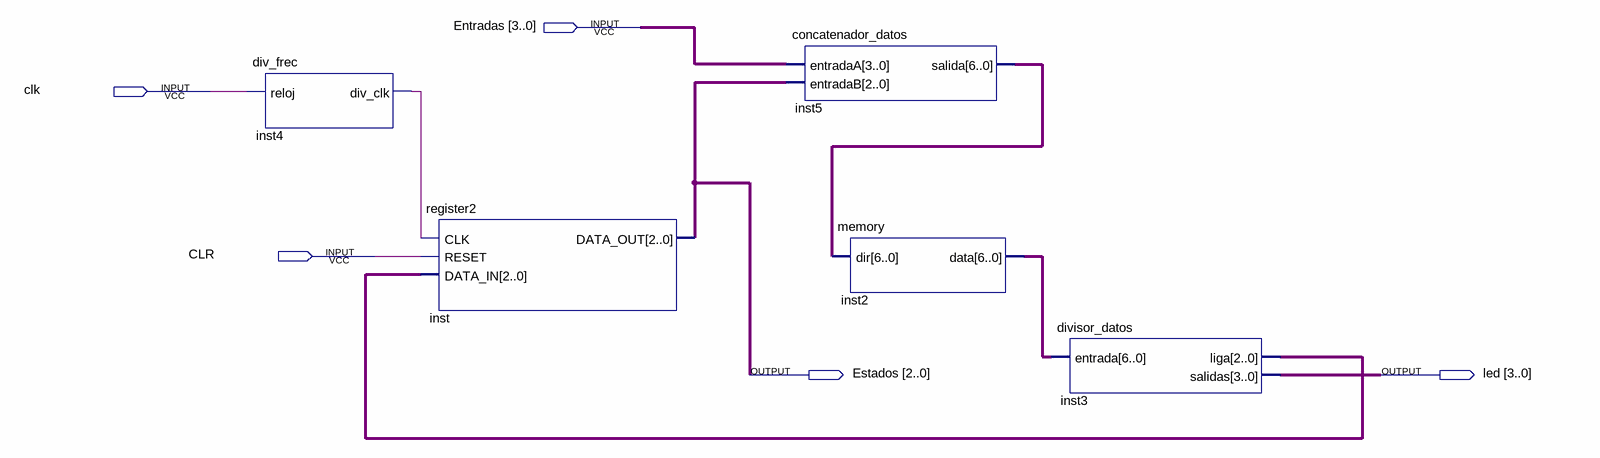
[diagram p0: schematic sheet]
// Quartus schematic practica3.bdf as structural Verilog: 5 symbols, 5 pins
module practica3 (
  input  [3:0] Entradas,
  input  clk,
  input  CLR,
  output [2:0] Estados,
  output [3:0] led
);

  wire inst4_div_clk;
  wire [2:0] inst3_liga;
  wire [6:0] inst2_data, inst5_salida;

  div_frec inst4 (.reloj(clk), .div_clk(inst4_div_clk));
  register2 inst (.CLK(inst4_div_clk), .RESET(CLR), .DATA_IN(inst3_liga), .DATA_OUT(Estados));
  concatenador_datos inst5 (.entradaA(Entradas), .entradaB(Estados), .salida(inst5_salida));
  memory inst2 (.dir(inst5_salida), .data(inst2_data));
  divisor_datos inst3 (.entrada(inst2_data), .liga(inst3_liga), .salidas(led));
endmodule
